# EasyEDA schematic exp4_2020-11-30_18-58-26.json
TITLE: Sheet_1; REV: 1.0; Date: 2020-11-30; Sheet: 1/1; Company: Your Company
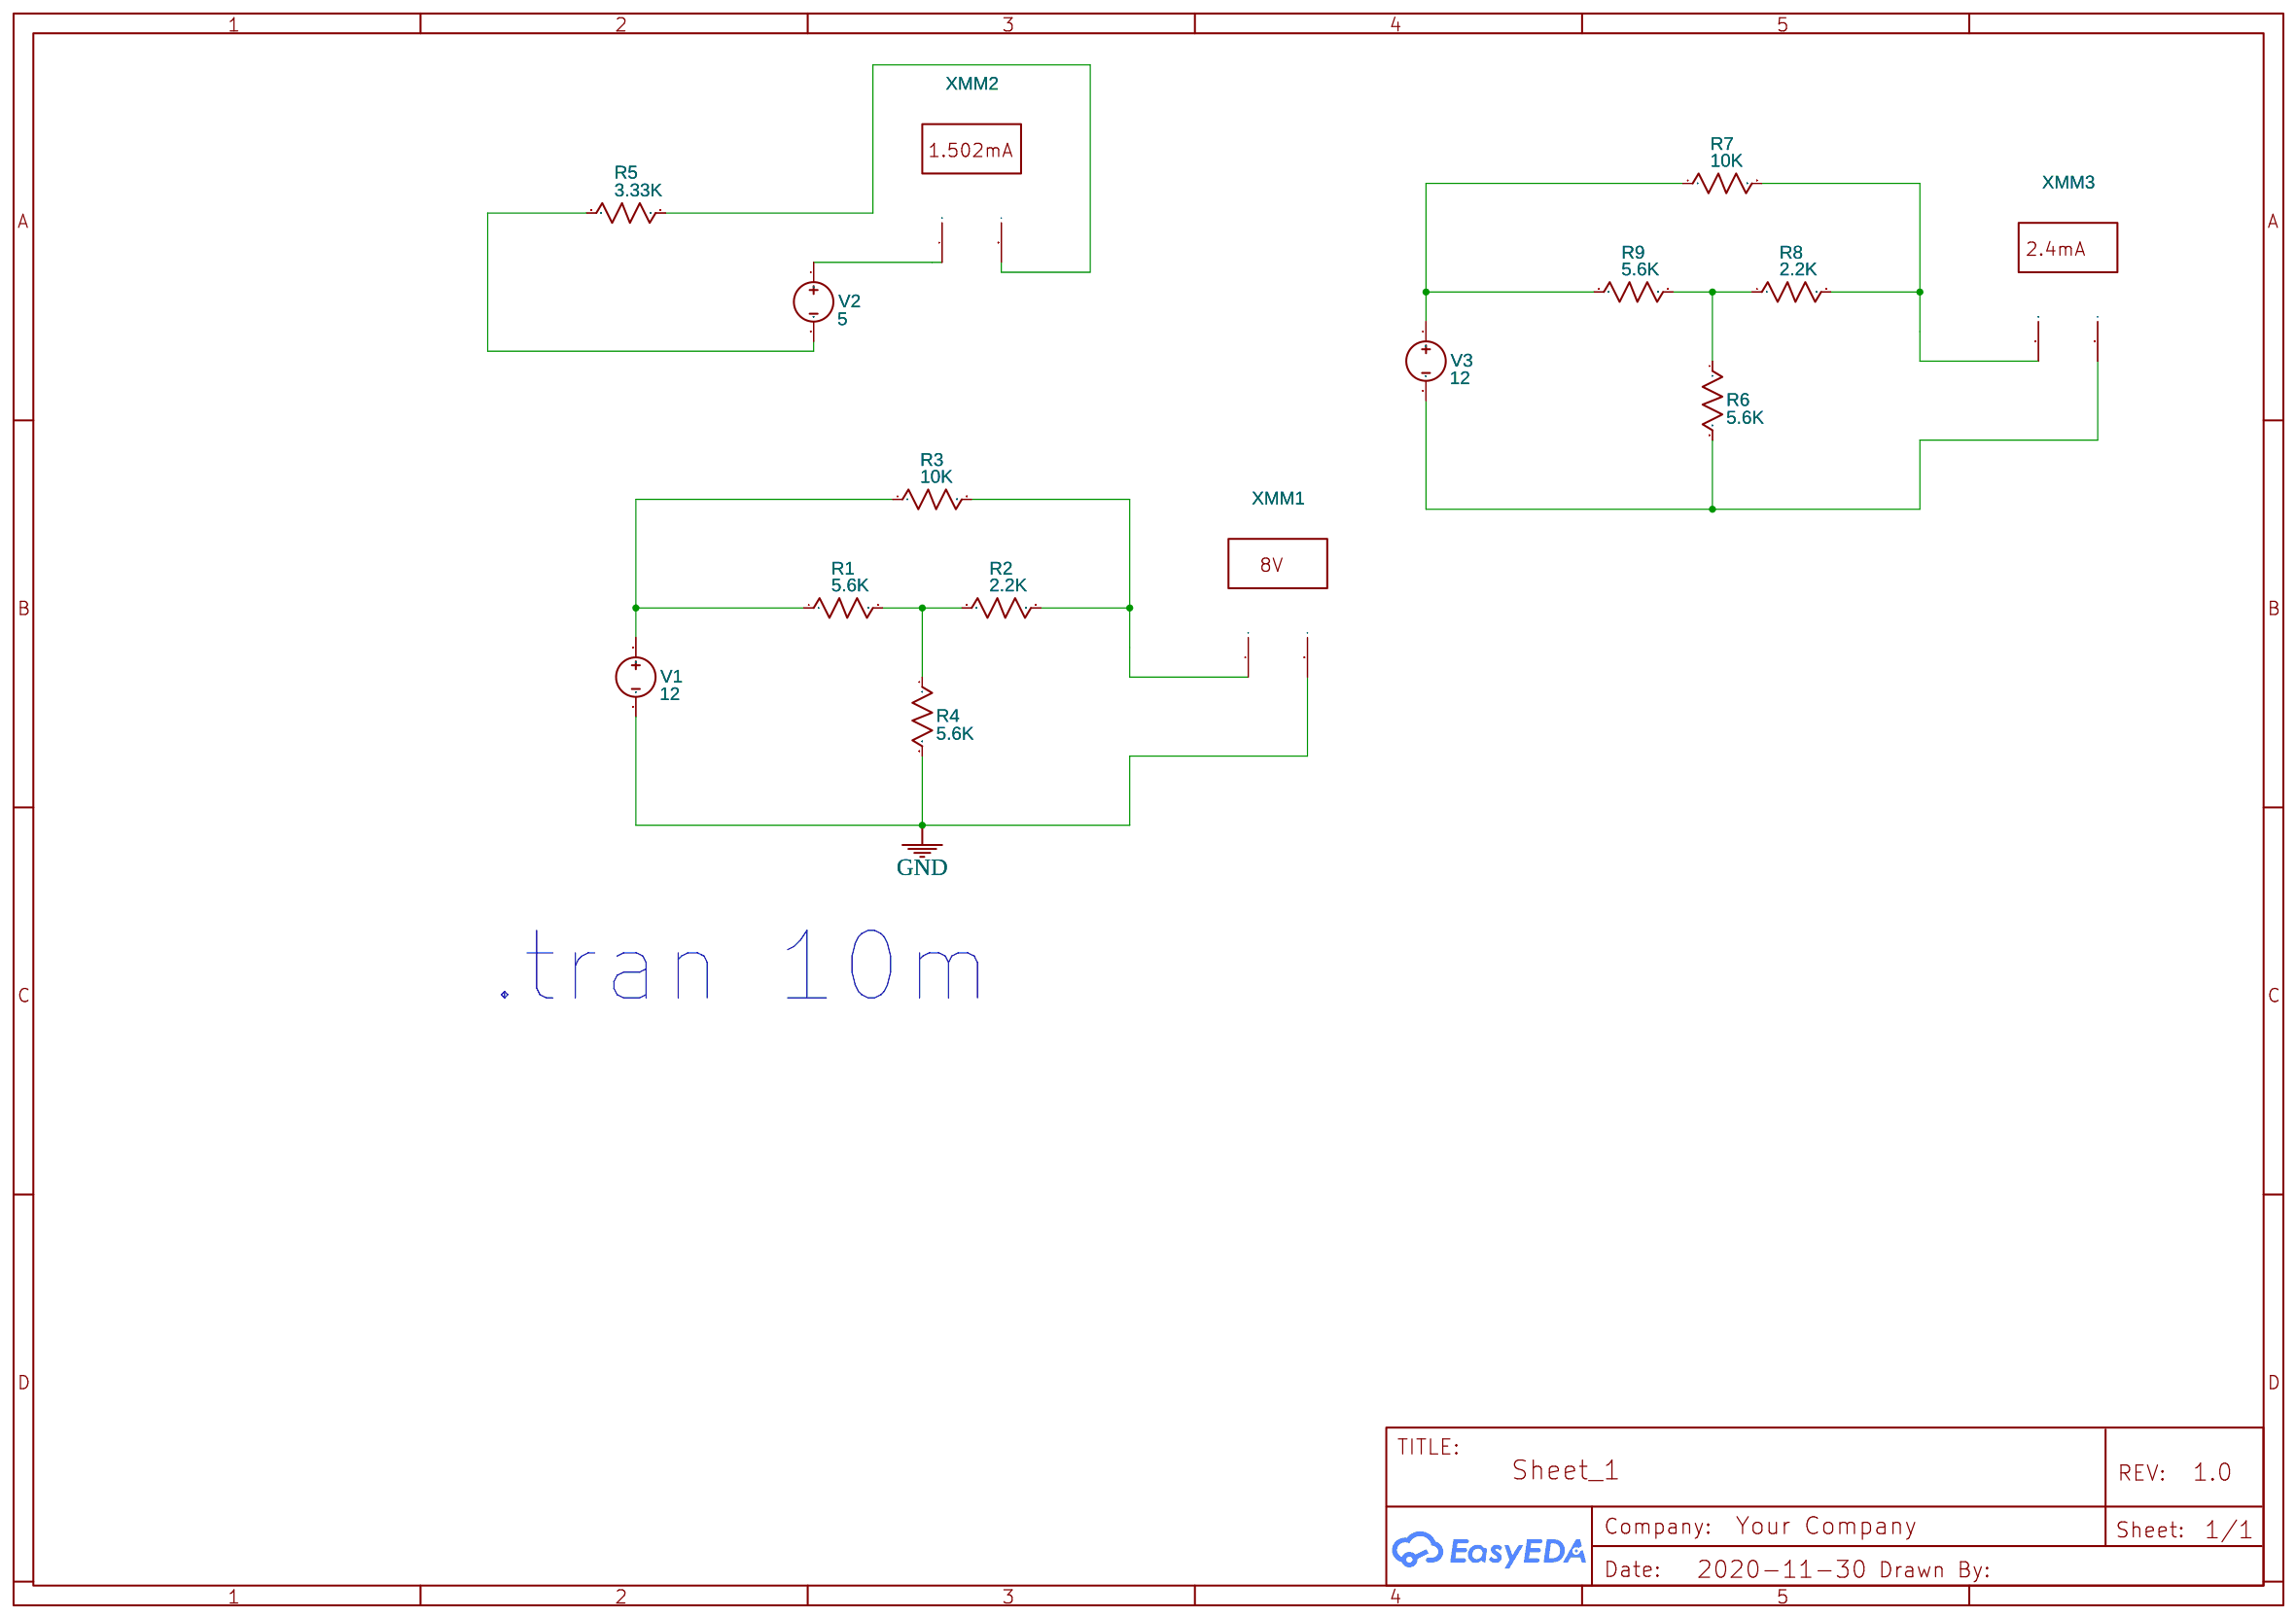
[diagram p0: schematic sheet]

## Parts
R1  5.6K  [AXIAL-0.3]
R2  2.2K  [AXIAL-0.3]
R3  10K  [AXIAL-0.3]
R4  5.6K  [AXIAL-0.3]
R5  3.33K  [AXIAL-0.3]
R6  5.6K  [AXIAL-0.3]
R7  10K  [AXIAL-0.3]
R8  2.2K  [AXIAL-0.3]
R9  5.6K  [AXIAL-0.3]
V1  12  [HDR1X2]
V2  5  [HDR1X2]
V3  12  [HDR1X2]
XMM1  Multimeter
XMM2  Multimeter
XMM3  Multimeter

## Library data of the parts
R1-R9 = Resistor_US: Resistance: 1k; Contributor: EasyEDA; Supplier: YUJING
V1-V3 = VDC: Contributor: EasyEDA; sim: true
XMM1 = MULTIMETER: Supplier: LCSC; Multimeter Type: Voltmeter; Power Type: AC; Voltmeter resistance: 10μ; Ammeter resistance: 1G; NameDisplay: 0; Contributor: EasyEDA; sim: true
XMM2 XMM3 = MULTIMETER: Supplier: LCSC; Multimeter Type: Amper; Power Type: AC; Voltmeter resistance: 10μ; Ammeter resistance: 1G; NameDisplay: 0; Contributor: EasyEDA; sim: true

## Nets
GND: R4.2 V1.2 XMM1.2(I)
Net-(R1-1): R1.1 R3.1 V1.1
Net-(R1-2): R1.2 R2.1 R4.1
Net-(R2-2): R2.2 R3.2 XMM1.1(+)
Net-(R5-1): R5.1 V2.2
Net-(R5-2): R5.2 XMM2.2(I)
Net-(R6-1): R6.1 R8.1 R9.2
Net-(R6-2): R6.2 V3.2 XMM3.2(I)
Net-(R7-1): R7.1 R9.1 V3.1
Net-(R7-2): R7.2 R8.2 XMM3.1(+)
Net-(V2-1): V2.1 XMM2.1(+)

## Notes on the sheet
- .tran 10m
